# Altium schematic sheet SY_HR08_MCU_MOTOR_V1.1.SchDoc
size A3; PageSetup: Record=PageOptions|CenterHorizontal=True|CenterVertical=True|PrintScale=0.71|XCorrection=1.00|YCorrection=1.00|PrintKind=2|BorderSize=5000000|LeftOffset=0|BottomOffset=0|Orientation=2|PaperLength=1000|PaperWidth=1000|Scale=100|PaperSource=7|PrintQuality=-3|MediaType=1|DitherType=10|PrintScaleMode=1|PaperKind=A4|PaperIndex=9
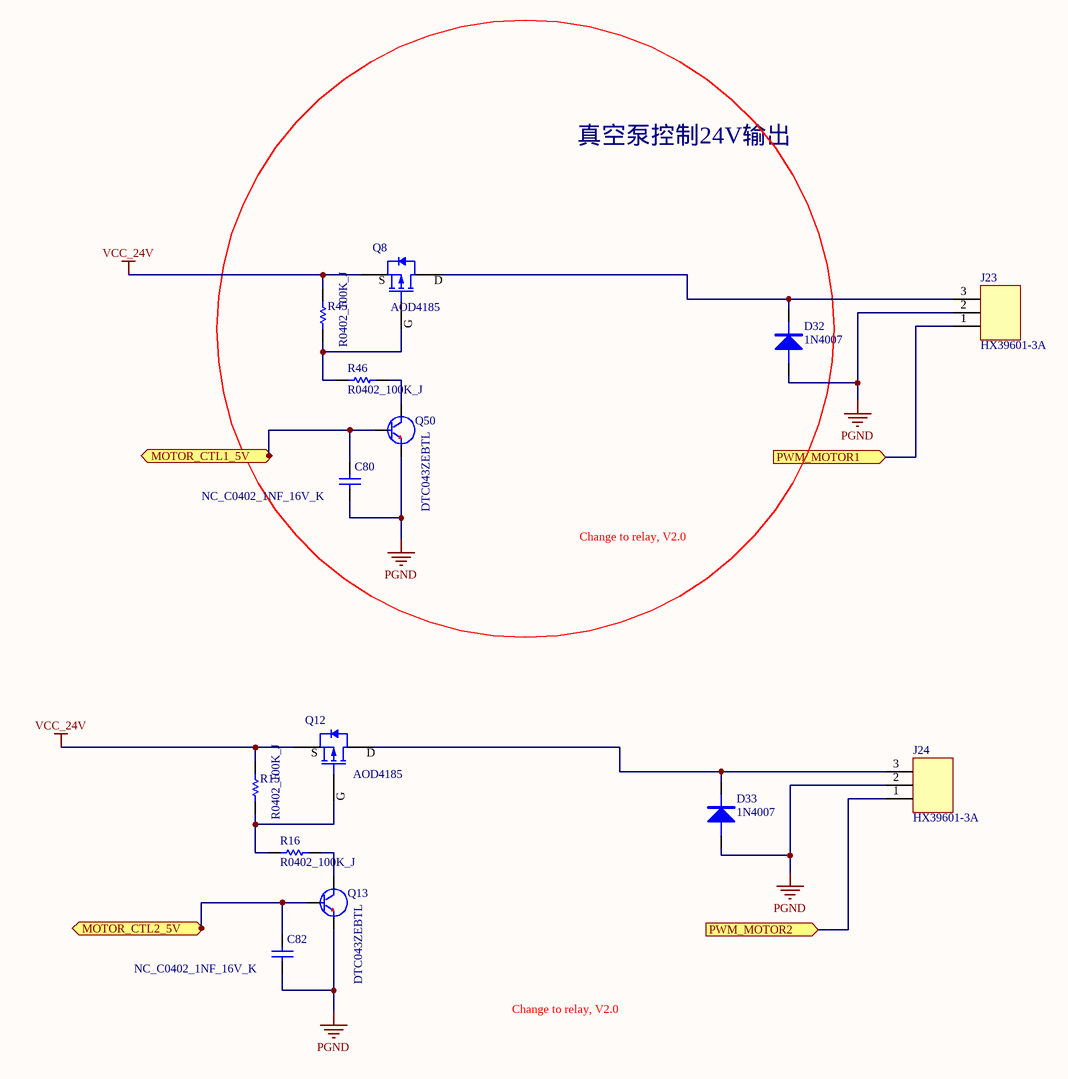
[diagram p0: SY_HR08_MCU_MOTOR_V1.1.SchDoc]

## Parts
C80  NC_C0402_1NF_16V_K  [CAP0402_HQ]
C82  NC_C0402_1NF_16V_K  [CAP0402_HQ]
D32  1N4007  [1N4007]
D33  1N4007  [1N4007]
J23  HX39601-3A  [HX39601-3A]
J24  HX39601-3A  [HX39601-3A]
Q8  AOD4185  [TO-252]
Q12  AOD4185  [TO-252]
Q13  DTC043ZEBTL  [DTC043ZEBTL$2F$$2F$DTC143ZE$2F$$2F$LDTC143ZET1G]
Q50  DTC043ZEBTL  [DTC043ZEBTL$2F$$2F$DTC143ZE$2F$$2F$LDTC143ZET1G]
R15  R0402_100K_J  [RES0402_HQ]
R16  R0402_100K_J  [RES0402_HQ]
R45  R0402_100K_J  [RES0402_HQ]
R46  R0402_100K_J  [RES0402_HQ]

## Ports
MOTOR_CTL1_5V (in), MOTOR_CTL2_5V (in), PWM_MOTOR1 (in), PWM_MOTOR2 (in)

## Nets
PGND: C80.2 C82.2 D32.2 D33.2 J23.2 J24.2 Q13.2(E) Q50.2(E)
VCC_24V: Q8.2(S) Q12.2(S) R15.2 R45.2
PWM_MOTOR1: J23.1 ; port PWM_MOTOR1
PWM_MOTOR2: J24.1 ; port PWM_MOTOR2
NetC80_1: C80.1 Q50.1(B)
NetC82_1: C82.1 Q13.1(B)
NetD32_1: D32.1 J23.3 Q8.3(D)
NetD33_1: D33.1 J24.3 Q12.3(D)
NetQ8_1: Q8.1(G) R45.1 R46.2
NetQ12_1: Q12.1(G) R15.1 R16.2
NetQ13_3: Q13.3(C) R16.1
NetQ50_3: Q50.3(C) R46.1

## Notes on the sheet
- 真空泵控制24V输出
- Change to relay, V2.0

## Library data of the parts
C80 C82 = C0402_100NF_16V_K: 电容_100nF_0402_X7R_16V_K; Geometry.Height: 0.55mm; Value: 100NF
D32 D33 = 1N4007: 1N4007 整流二极管 1A 1000V
J23 J24 = HX39601-3A: HX39601-3A 3.96mm
Q8 Q12 = PMOS  TO252
Q13 Q50 = DTC043ZEBTL: NPN三极管_100mA_EMT3F
R15 R16 R45 R46 = R0402_100K_J: 电阻100K(0402-0.0625W-J)